# EAGLE schematic 45_Temp-Serial_01 (EAGLE 7.4.0)
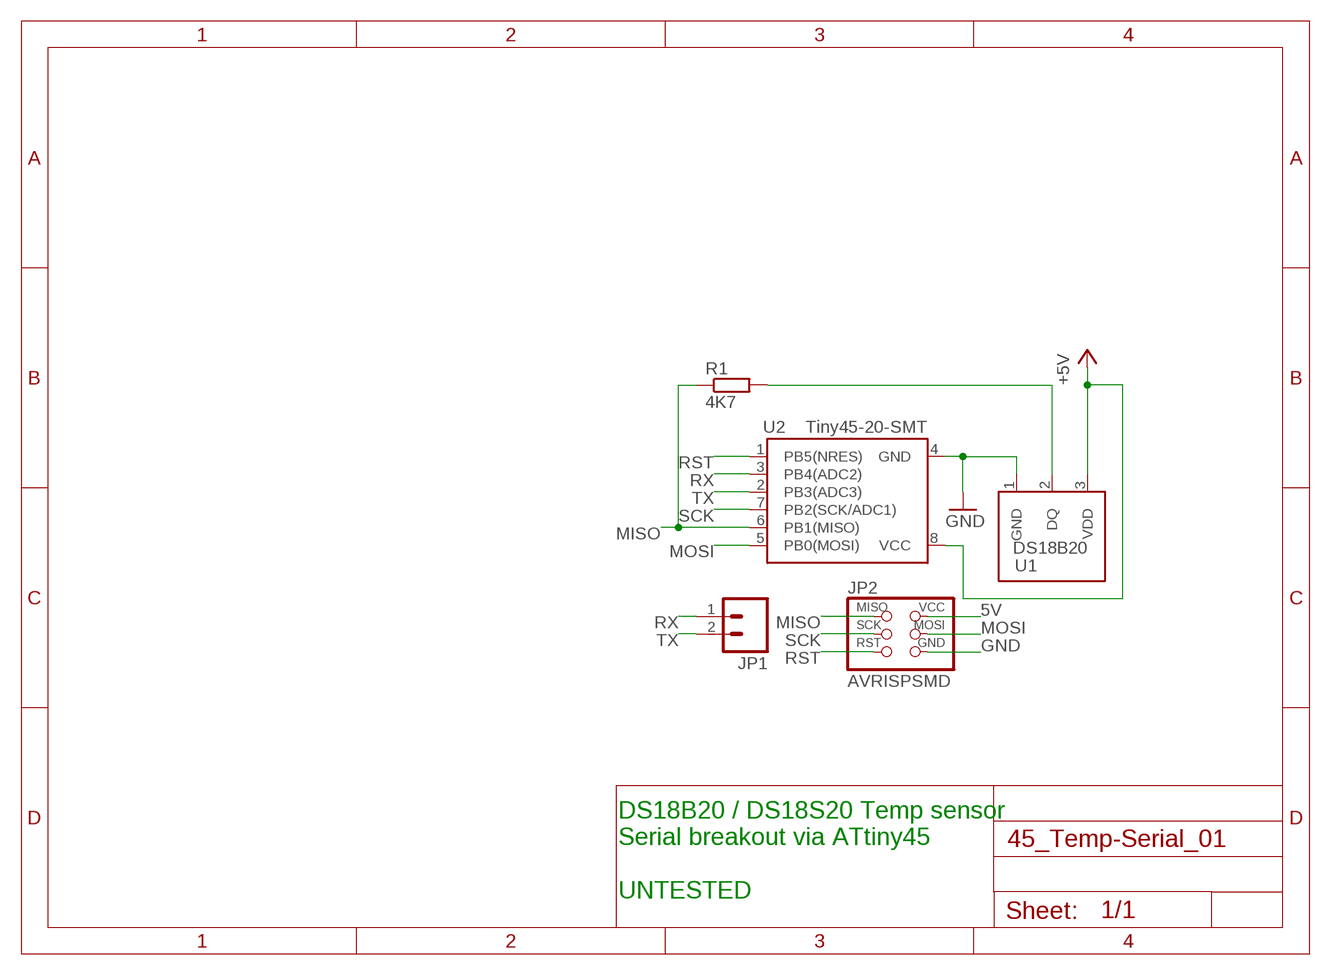
[diagram p0: schematic, sheet 1]

## Parts
JP1  M02LOCK_LONGPADS  [1X02_LOCK_LONGPADS]
JP2  AVRISPSMD  [2X03SMD]
R1  4K7  R-EU_R1206  [R1206]
U1  DS18B20  [TO-92-AMMO]
U2  Tiny45-20-SMT  ATTINY45TINY45-20-SMT  [SO08-EIAJ]

## Nets
5V: JP2.2(VCC) U1.3(VDD) U2.8(VCC) ; supply symbol labelled +5V
GND: JP2.6(GND) U1.1(GND) U2.4(GND)
MISO: JP2.1(MISO) R1.1 U2.6(PB1(MISO))
MOSI: JP2.4(MOSI) U2.5(PB0(MOSI))
N$1: R1.2 U1.2(DQ)
RST: JP2.5(RST) U2.1(PB5(NRES))
RX: JP1.1 U2.3(PB4(ADC2))
SCK: JP2.3(SCK) U2.7(PB2(SCK/ADC1))
TX: JP1.2 U2.2(PB3(ADC3))

## Notes on the sheet
- DS18B20 / DS18S20 Temp sensor
  Serial breakout via ATtiny45
  
  UNTESTED

## Library data of the parts
JP1 = SparkFun-Connectors:M02: Standard 2-pin 0.1" header. Use with - straight break away headers ( PRT-00116) - right angle break away headers (PRT-00553) - swiss pins (PRT-00743) - machine pins (PRT-00117) - female headers (PRT-00115) Molex polarized connector foot print use with: PRT-08233 with associated crimp pins and housings. 2.54_SCREWTERM for use with PRT-10571. 3.5mm Screw Terminal footprints for PRT-08084 5mm Screw Terminal footprints for use with PRT-08432
JP2 = fab:AVRISP
R1 = resistor:R-EU_: RESISTOR, European symbol
U1 = SparkFun-Sensors:DS18B20: Dallas/Maxim DS18B20 1-wire temperature sensor Datasheet: http://datasheets.maximintegrated.com/en/ds/DS18B20.pdf temp thermometer 1-wire one-wire one wire; STORE_ID: SEN-00245
U2 = SparkFun-DigitalIC:ATTINY45: Atmel 8-pin 2/4/8kB flash uC; PROD_ID: IC-08922